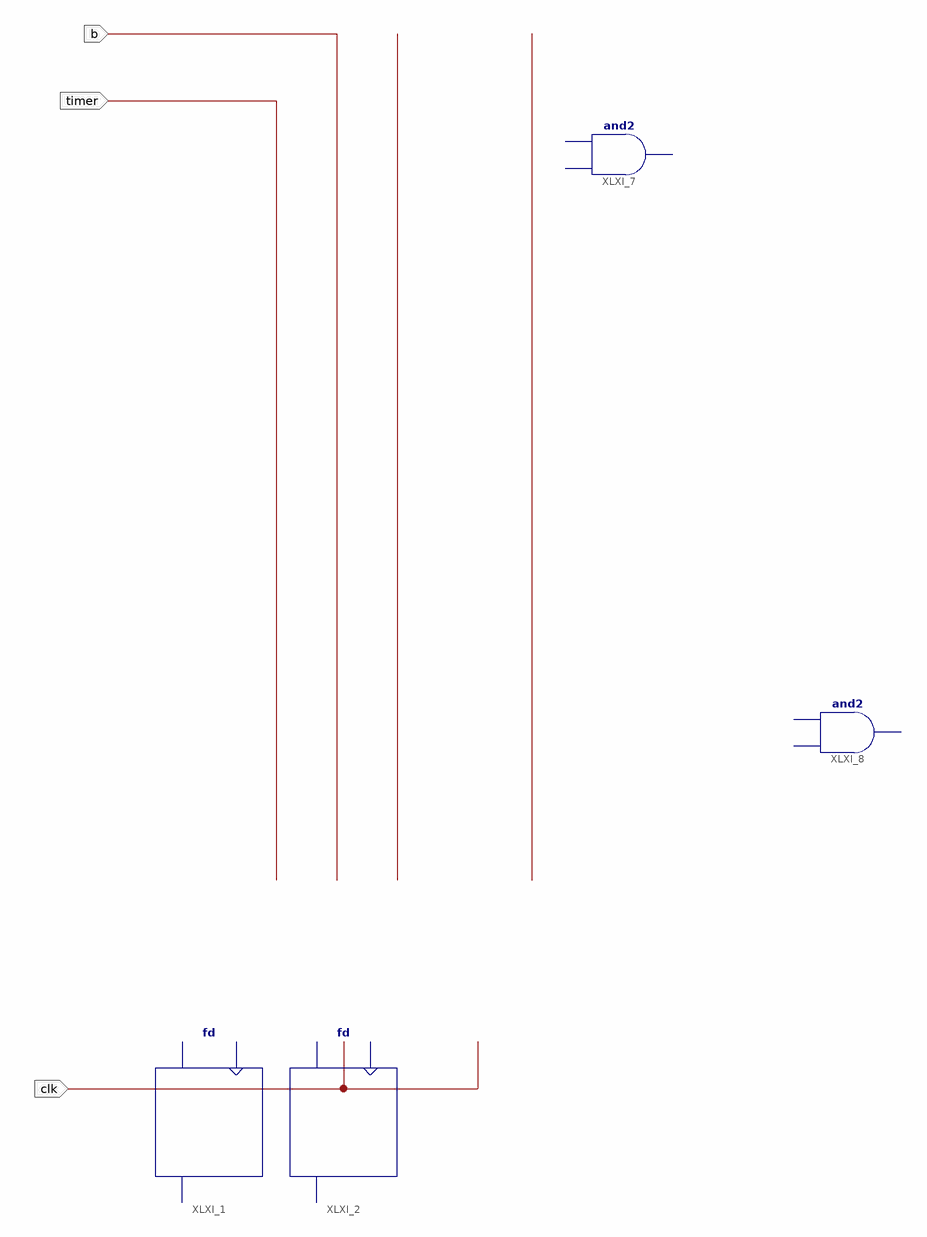
[diagram p0: schematic sheet 1]
// Xilinx ISE schematic controller.sch (spartan3e) as structural Verilog: 4 symbols, 3 ports
module controller (
  input  clk,
  input  b,
  input  timer
);

  wire XLXN_3, XLXN_4;

  fd XLXI_1 (.C(clk), .Q(XLXN_3));  // open: D
  fd XLXI_2 (.C(clk), .Q(XLXN_4));  // open: D
  // and2 XLXI_7 is placed but not wired
  // and2 XLXI_8 is placed but not wired
endmodule
